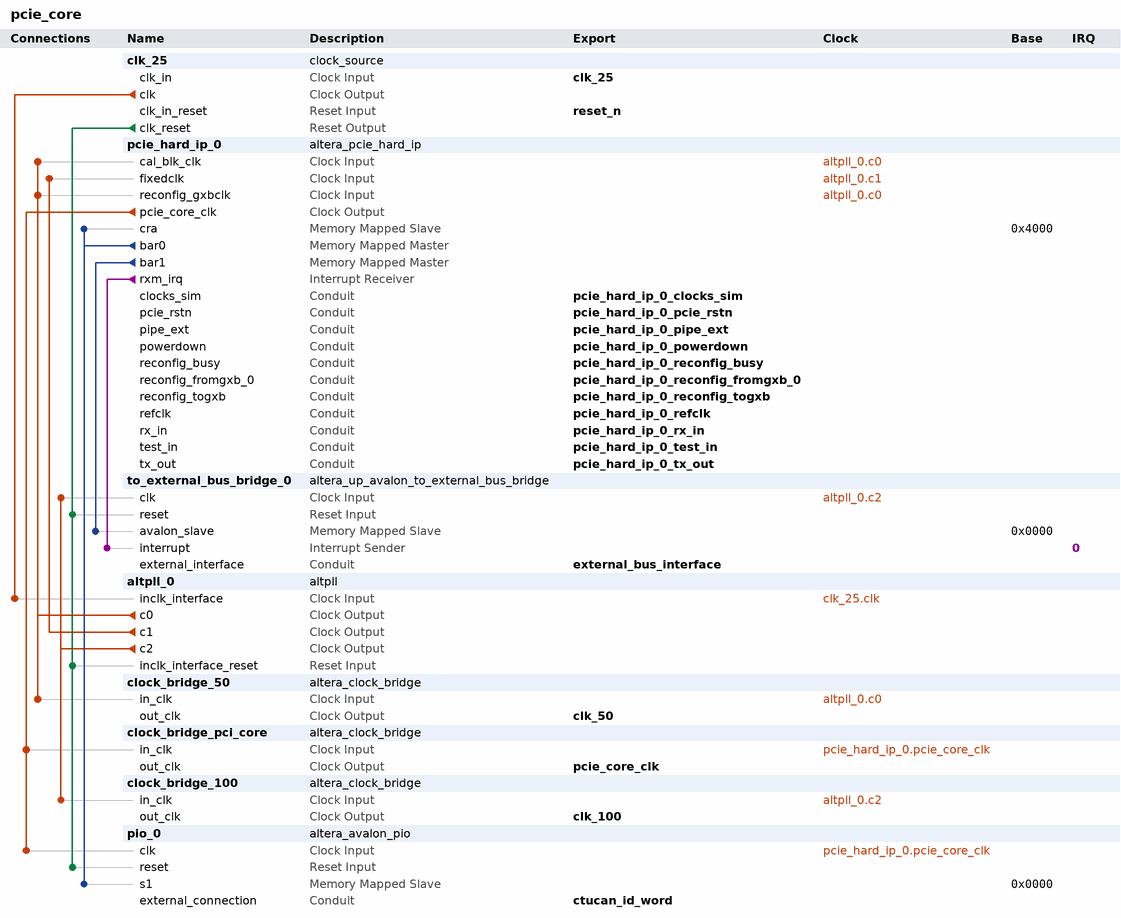
[diagram p0: system contents]
# Platform Designer (Qsys) system pcie_core, Cyclone IV GX EP4CGX15BF14C6
# Parameters at their usual value, and those the tool derives, are not listed.
package require -exact qsys 17.0
create_system pcie_core
set_project_property DEVICE_FAMILY {Cyclone IV GX}
set_project_property DEVICE EP4CGX15BF14C6

add_instance clk_25 clock_source 17.0
set_instance_parameter_value clk_25 clockFrequency 25000000

add_instance pcie_hard_ip_0 altera_pcie_hard_ip 17.0
set_instance_parameter_value pcie_hard_ip_0 {BAR Type} {32 bit Non-Prefetchable,32 bit Non-Prefetchable,Not used,Not used,Not used,Not used}
set_instance_parameter_value pcie_hard_ip_0 CB_A2P_ADDR_MAP_PASS_THRU_BITS 32
set_instance_parameter_value pcie_hard_ip_0 CG_ENABLE_A2P_INTERRUPT 0
set_instance_parameter_value pcie_hard_ip_0 CG_NO_CPL_REORDERING 0
set_instance_parameter_value pcie_hard_ip_0 {PCIe Address 31:0} 0x00000000,0x00000000,0x00000000,0x00000000,0x00000000,0x00000000,0x00000000,0x00000000,0x00000000,0x00000000,0x00000000,0x00000000,0x00000000,0x00000000,0x00000000,0x00000000
set_instance_parameter_value pcie_hard_ip_0 {PCIe Address 63:32} 0x00000000,0x00000000,0x00000000,0x00000000,0x00000000,0x00000000,0x00000000,0x00000000,0x00000000,0x00000000,0x00000000,0x00000000,0x00000000,0x00000000,0x00000000,0x00000000
set_instance_parameter_value pcie_hard_ip_0 class_code 65280
set_instance_parameter_value pcie_hard_ip_0 device_id 65280
set_instance_parameter_value pcie_hard_ip_0 my_advanced_errors false
set_instance_parameter_value pcie_hard_ip_0 my_enable_ecrc_check false
set_instance_parameter_value pcie_hard_ip_0 my_enable_ecrc_gen false
set_instance_parameter_value pcie_hard_ip_0 p_pcie_test_out_width None
set_instance_parameter_value pcie_hard_ip_0 p_user_msi_enable 0
set_instance_parameter_value pcie_hard_ip_0 subsystem_device_id 65280
set_instance_parameter_value pcie_hard_ip_0 subsystem_vendor_id 5984
set_instance_parameter_value pcie_hard_ip_0 vendor_id 5984

add_instance to_external_bus_bridge_0 altera_up_avalon_to_external_bus_bridge 17.0
set_instance_parameter_value to_external_bus_bridge_0 addr_size 64
set_instance_parameter_value to_external_bus_bridge_0 addr_size_multiplier Kbytes
set_instance_parameter_value to_external_bus_bridge_0 data_size 32

add_instance altpll_0 altpll 17.0
set_instance_parameter_value altpll_0 CLK0_DIVIDE_BY 1
set_instance_parameter_value altpll_0 CLK0_MULTIPLY_BY 2
set_instance_parameter_value altpll_0 CLK1_DIVIDE_BY 1
set_instance_parameter_value altpll_0 CLK1_DUTY_CYCLE 50
set_instance_parameter_value altpll_0 CLK1_MULTIPLY_BY 5
set_instance_parameter_value altpll_0 CLK1_PHASE_SHIFT 0
set_instance_parameter_value altpll_0 CLK2_DIVIDE_BY 1
set_instance_parameter_value altpll_0 CLK2_DUTY_CYCLE 50
set_instance_parameter_value altpll_0 CLK2_MULTIPLY_BY 4
set_instance_parameter_value altpll_0 CLK2_PHASE_SHIFT 0
set_instance_parameter_value altpll_0 INCLK0_INPUT_FREQUENCY 40000
set_instance_parameter_value altpll_0 PORT_ARESET PORT_USED
set_instance_parameter_value altpll_0 PORT_LOCKED PORT_USED
set_instance_parameter_value altpll_0 PORT_clk1 PORT_USED
set_instance_parameter_value altpll_0 PORT_clk2 PORT_USED
set_instance_parameter_value altpll_0 PORT_clk3 PORT_UNUSED

add_instance clock_bridge_50 altera_clock_bridge 17.0
set_instance_parameter_value clock_bridge_50 DERIVED_CLOCK_RATE 50000000
set_instance_parameter_value clock_bridge_50 EXPLICIT_CLOCK_RATE 0

add_instance clock_bridge_pci_core altera_clock_bridge 17.0
set_instance_parameter_value clock_bridge_pci_core DERIVED_CLOCK_RATE 125000000
set_instance_parameter_value clock_bridge_pci_core EXPLICIT_CLOCK_RATE 0

add_instance clock_bridge_100 altera_clock_bridge 17.0
set_instance_parameter_value clock_bridge_100 DERIVED_CLOCK_RATE 100000000
set_instance_parameter_value clock_bridge_100 EXPLICIT_CLOCK_RATE 0

add_instance pio_0 altera_avalon_pio 17.0
set_instance_parameter_value pio_0 direction Input
set_instance_parameter_value pio_0 width 32

# connections
add_connection altpll_0.c0 clock_bridge_50.in_clk clock
add_connection altpll_0.c0 pcie_hard_ip_0.cal_blk_clk clock
add_connection altpll_0.c0 pcie_hard_ip_0.reconfig_gxbclk clock
add_connection altpll_0.c1 pcie_hard_ip_0.fixedclk clock
add_connection altpll_0.c2 clock_bridge_100.in_clk clock
add_connection altpll_0.c2 to_external_bus_bridge_0.clk clock
add_connection clk_25.clk altpll_0.inclk_interface clock
add_connection pcie_hard_ip_0.pcie_core_clk clock_bridge_pci_core.in_clk clock
add_connection pcie_hard_ip_0.pcie_core_clk pio_0.clk clock
add_connection clk_25.clk_reset altpll_0.inclk_interface_reset reset
add_connection clk_25.clk_reset pio_0.reset reset
add_connection clk_25.clk_reset to_external_bus_bridge_0.reset reset
add_connection pcie_hard_ip_0.bar0 pcie_hard_ip_0.cra avalon
set_connection_parameter_value pcie_hard_ip_0.bar0/pcie_hard_ip_0.cra baseAddress 0x4000
add_connection pcie_hard_ip_0.bar0 pio_0.s1 avalon
set_connection_parameter_value pcie_hard_ip_0.bar0/pio_0.s1 baseAddress 0x0000
add_connection pcie_hard_ip_0.bar1 to_external_bus_bridge_0.avalon_slave avalon
set_connection_parameter_value pcie_hard_ip_0.bar1/to_external_bus_bridge_0.avalon_slave baseAddress 0x0000
add_connection pcie_hard_ip_0.rxm_irq to_external_bus_bridge_0.interrupt interrupt
set_connection_parameter_value pcie_hard_ip_0.rxm_irq/to_external_bus_bridge_0.interrupt irqNumber 0

# exported interfaces
add_interface clk_100 clock source
set_interface_property clk_100 EXPORT_OF clock_bridge_100.out_clk
add_interface clk_25 clock sink
set_interface_property clk_25 EXPORT_OF clk_25.clk_in
add_interface clk_50 clock source
set_interface_property clk_50 EXPORT_OF clock_bridge_50.out_clk
add_interface ctucan_id_word conduit end
set_interface_property ctucan_id_word EXPORT_OF pio_0.external_connection
add_interface external_bus_interface conduit end
set_interface_property external_bus_interface EXPORT_OF to_external_bus_bridge_0.external_interface
add_interface pcie_core_clk clock source
set_interface_property pcie_core_clk EXPORT_OF clock_bridge_pci_core.out_clk
add_interface pcie_hard_ip_0_clocks_sim conduit end
set_interface_property pcie_hard_ip_0_clocks_sim EXPORT_OF pcie_hard_ip_0.clocks_sim
add_interface pcie_hard_ip_0_pcie_rstn conduit end
set_interface_property pcie_hard_ip_0_pcie_rstn EXPORT_OF pcie_hard_ip_0.pcie_rstn
add_interface pcie_hard_ip_0_pipe_ext conduit end
set_interface_property pcie_hard_ip_0_pipe_ext EXPORT_OF pcie_hard_ip_0.pipe_ext
add_interface pcie_hard_ip_0_powerdown conduit end
set_interface_property pcie_hard_ip_0_powerdown EXPORT_OF pcie_hard_ip_0.powerdown
add_interface pcie_hard_ip_0_reconfig_busy conduit end
set_interface_property pcie_hard_ip_0_reconfig_busy EXPORT_OF pcie_hard_ip_0.reconfig_busy
add_interface pcie_hard_ip_0_reconfig_fromgxb_0 conduit end
set_interface_property pcie_hard_ip_0_reconfig_fromgxb_0 EXPORT_OF pcie_hard_ip_0.reconfig_fromgxb_0
add_interface pcie_hard_ip_0_reconfig_togxb conduit end
set_interface_property pcie_hard_ip_0_reconfig_togxb EXPORT_OF pcie_hard_ip_0.reconfig_togxb
add_interface pcie_hard_ip_0_refclk conduit end
set_interface_property pcie_hard_ip_0_refclk EXPORT_OF pcie_hard_ip_0.refclk
add_interface pcie_hard_ip_0_rx_in conduit end
set_interface_property pcie_hard_ip_0_rx_in EXPORT_OF pcie_hard_ip_0.rx_in
add_interface pcie_hard_ip_0_test_in conduit end
set_interface_property pcie_hard_ip_0_test_in EXPORT_OF pcie_hard_ip_0.test_in
add_interface pcie_hard_ip_0_tx_out conduit end
set_interface_property pcie_hard_ip_0_tx_out EXPORT_OF pcie_hard_ip_0.tx_out
add_interface reset_n reset sink
set_interface_property reset_n EXPORT_OF clk_25.clk_in_reset

set_interconnect_requirement {$system} qsys_mm.clockCrossingAdapter HANDSHAKE
set_interconnect_requirement {$system} qsys_mm.enableEccProtection FALSE
set_interconnect_requirement {$system} qsys_mm.insertDefaultSlave FALSE
set_interconnect_requirement {$system} qsys_mm.maxAdditionalLatency 1

save_system pcie_core.qsys
